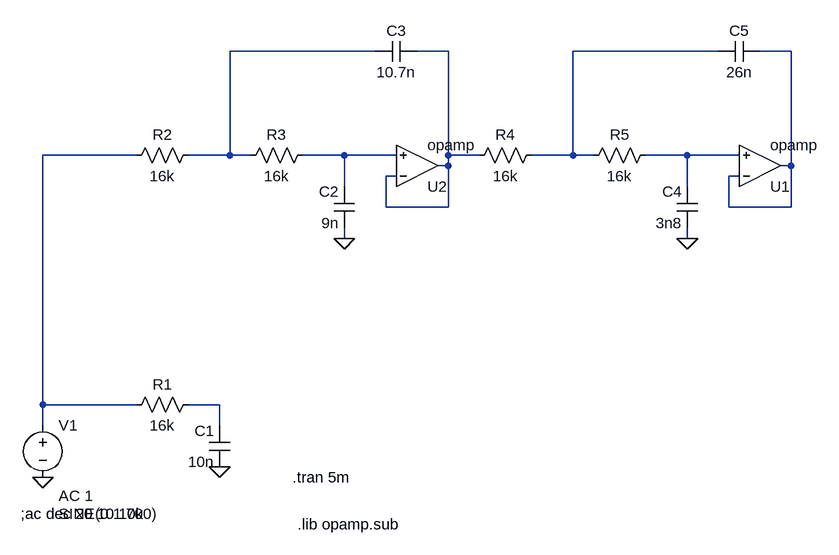
[diagram p0: schematic Draft3.asc]
Draft3.asc, the LTspice schematic file:
Version 4
SHEET 1 1160 680
WIRE 512 -368 288 -368
WIRE 624 -368 576 -368
WIRE 1040 -368 816 -368
WIRE 1152 -368 1104 -368
WIRE 144 -208 0 -208
WIRE 288 -208 288 -368
WIRE 288 -208 224 -208
WIRE 320 -208 288 -208
WIRE 464 -208 400 -208
WIRE 544 -208 464 -208
WIRE 624 -208 624 -368
WIRE 672 -208 624 -208
WIRE 816 -208 816 -368
WIRE 816 -208 752 -208
WIRE 848 -208 816 -208
WIRE 992 -208 928 -208
WIRE 1072 -208 992 -208
WIRE 624 -192 624 -208
WIRE 624 -192 608 -192
WIRE 1152 -192 1152 -368
WIRE 1152 -192 1136 -192
WIRE 544 -176 528 -176
WIRE 1072 -176 1056 -176
WIRE 464 -160 464 -208
WIRE 992 -160 992 -208
WIRE 528 -128 528 -176
WIRE 624 -128 624 -192
WIRE 624 -128 528 -128
WIRE 1056 -128 1056 -176
WIRE 1152 -128 1152 -192
WIRE 1152 -128 1056 -128
WIRE 464 -80 464 -96
WIRE 992 -80 992 -96
WIRE 0 176 0 -208
WIRE 144 176 0 176
WIRE 272 176 224 176
WIRE 0 208 0 176
WIRE 272 208 272 176
FLAG 0 288 0
FLAG 272 272 0
FLAG 464 -80 0
FLAG 992 -80 0
SYMBOL res 240 160 R90
WINDOW 0 0 56 VBottom 2
WINDOW 3 32 56 VTop 2
SYMATTR InstName R1
SYMATTR Value 16k
SYMBOL cap 288 272 R180
WINDOW 0 24 56 Left 2
WINDOW 3 24 8 Left 2
SYMATTR InstName C1
SYMATTR Value 10n
SYMBOL voltage 0 192 R0
WINDOW 3 24 152 Left 2
WINDOW 123 24 124 Left 2
WINDOW 39 0 0 Left 2
SYMATTR InstName V1
SYMATTR Value SINE(0 1 700)
SYMATTR Value2 AC 1
SYMBOL res 240 -224 R90
WINDOW 0 0 56 VBottom 2
WINDOW 3 32 56 VTop 2
SYMATTR InstName R2
SYMATTR Value 16k
SYMBOL res 416 -224 R90
WINDOW 0 0 56 VBottom 2
WINDOW 3 32 56 VTop 2
SYMATTR InstName R3
SYMATTR Value 16k
SYMBOL cap 480 -96 R180
WINDOW 0 24 56 Left 2
WINDOW 3 24 8 Left 2
SYMATTR InstName C2
SYMATTR Value 9n
SYMBOL cap 512 -352 R270
WINDOW 0 32 32 VTop 2
WINDOW 3 0 32 VBottom 2
SYMATTR InstName C3
SYMATTR Value 10.7n
SYMBOL Opamps\\opamp 576 -128 M180
SYMATTR InstName U2
SYMBOL res 768 -224 R90
WINDOW 0 0 56 VBottom 2
WINDOW 3 32 56 VTop 2
SYMATTR InstName R4
SYMATTR Value 16k
SYMBOL res 944 -224 R90
WINDOW 0 0 56 VBottom 2
WINDOW 3 32 56 VTop 2
SYMATTR InstName R5
SYMATTR Value 16k
SYMBOL cap 1008 -96 R180
WINDOW 0 24 56 Left 2
WINDOW 3 24 8 Left 2
SYMATTR InstName C4
SYMATTR Value 3n8
SYMBOL cap 1040 -352 R270
WINDOW 0 32 32 VTop 2
WINDOW 3 0 32 VBottom 2
SYMATTR InstName C5
SYMATTR Value 26n
SYMBOL Opamps\\opamp 1104 -128 M180
SYMATTR InstName U1
TEXT -34 344 Left 2 !;ac dec 20 10 10k
TEXT 392 360 Left 2 !.lib opamp.sub
TEXT 384 288 Left 2 !.tran 5m

The netlist it stands for:
* Draft3.asc
R1 N008 N005 16k
C1 0 N008 10n
V1 N005 0 SINE(0 1 700) AC 1
R2 N001 N005 16k
R3 N006 N001 16k
C2 0 N006 9n
C3 N001 N002 10.7n
XU2 N002 N006 N002 opamp Aol=100K GBW=10Meg  ; pins invin noninvin out
R4 N003 N002 16k
R5 N007 N003 16k
C4 0 N007 3n8
C5 N003 N004 26n
XU1 N004 N007 N004 opamp Aol=100K GBW=10Meg  ; pins invin noninvin out
;ac dec 20 10 10k
.lib opamp.sub
.tran 5m
.backanno
.end